# Altium schematic sheet Processor_Power.SchDoc
size 431 x 279 mm; Organization: ORGANIZATION; Address1: ADDRESS 1; Address2: ADDRESS 2; Address3: ADDRESS 3; Address4: ADDRESS 4; Revision: -; SheetNumber: 6; SheetTotal: 8; ENG_APP_DATE: --/--/--; DSN_APP_DATE: --/--/--; CHK_APP_DATE: --/--/--
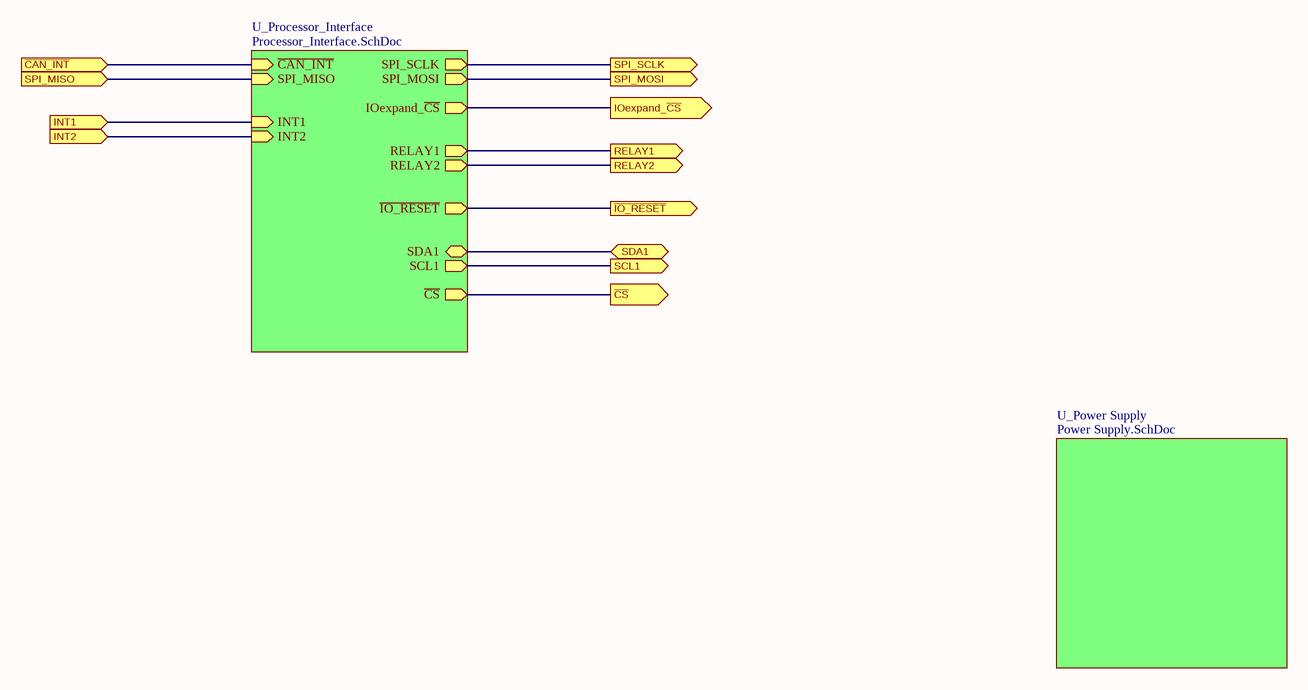
[diagram p0: Processor_Power.SchDoc]

## Sub-sheets
U_Power Supply = Power Supply.SchDoc: no entries
U_Processor_Interface = Processor_Interface.SchDoc: ~{CAN_INT} (in), SPI_SCLK (out), SPI_MOSI (out), SPI_MISO (in), IOexpand_~{CS} (out), RELAY1 (out), RELAY2 (out), INT1 (in), INT2 (in), ~{IO_RESET} (out), SDA1 (bidir), SCL1 (out), ~{CS} (out)

## Ports
INT1 (in), INT2 (in), IOexpand_~{CS} (out), RELAY1 (out), RELAY2 (out), SCL1 (out), SDA1 (bidir), SPI_MISO (in), SPI_MOSI (out), SPI_SCLK (out), ~{CAN_INT} (in), ~{CS} (out), ~{IO_RESET} (out)

## Nets
~{CAN_INT}: port ~{CAN_INT}, sheet U_Processor_Interface/~{CAN_INT}
~{IO_RESET}: port ~{IO_RESET}, sheet U_Processor_Interface/~{IO_RESET}
~{CS}: port ~{CS}, sheet U_Processor_Interface/~{CS}
INT1: port INT1, sheet U_Processor_Interface/INT1
INT2: port INT2, sheet U_Processor_Interface/INT2
IOexpand_~{CS}: port IOexpand_~{CS}, sheet U_Processor_Interface/IOexpand_~{CS}
RELAY1: port RELAY1, sheet U_Processor_Interface/RELAY1
RELAY2: port RELAY2, sheet U_Processor_Interface/RELAY2
SCL1: port SCL1, sheet U_Processor_Interface/SCL1
SDA1: port SDA1, sheet U_Processor_Interface/SDA1
SPI_MISO: port SPI_MISO, sheet U_Processor_Interface/SPI_MISO
SPI_MOSI: port SPI_MOSI, sheet U_Processor_Interface/SPI_MOSI
SPI_SCLK: port SPI_SCLK, sheet U_Processor_Interface/SPI_SCLK

## Notes on the sheet
- DWG. NO.
- REV.
- SHT.
- THIS DOCUMENT AND THE DATA DISCLOSED HEREIN OR HEREWITH IS THE PROPERTY OF ALTIUM LIMITED AND MAY BE FREELY DISTRIBUTED IN WHOLE. NO RIGHTS ARE RESERVED OR EXPRESS OR IMPLIED WARANTEE GIVEN.
- REVISION
- DESCRIPTION
- DATE
- APPROVED
- ENG:
- DSN:
- APPROVALS
- PROJECT REVISION:
- www.altium.com <http://www.altium.com>
- DOCUMENT REVISION:
- 92037, La Jolla
- USA
- Altium Ltd.
- 4225 Executive Square
- CHK:
- REFERENCE DOCUMENTS
- DESIGN ITEM:
- TITLE
- VARIANT
- BOM:
- FAB DWG:
- PCB DWG:
- ASSY DWG:
- SCALE:
- SIZE
- B
- CAGE CODE
- FILE NAME
- DWG NO.
- SHEET
- OF
- REV